# Altium schematic sheet 6ways-IDC-Cable-Tester.SchDoc
size A3; CompanyName: RELECTRIFY PTY LTD; Address1: Unit 4 113-117 Adderley St; Address2: West Melbourne, Victoria; Address3: Australia 3003; ProjectName: ProjectName
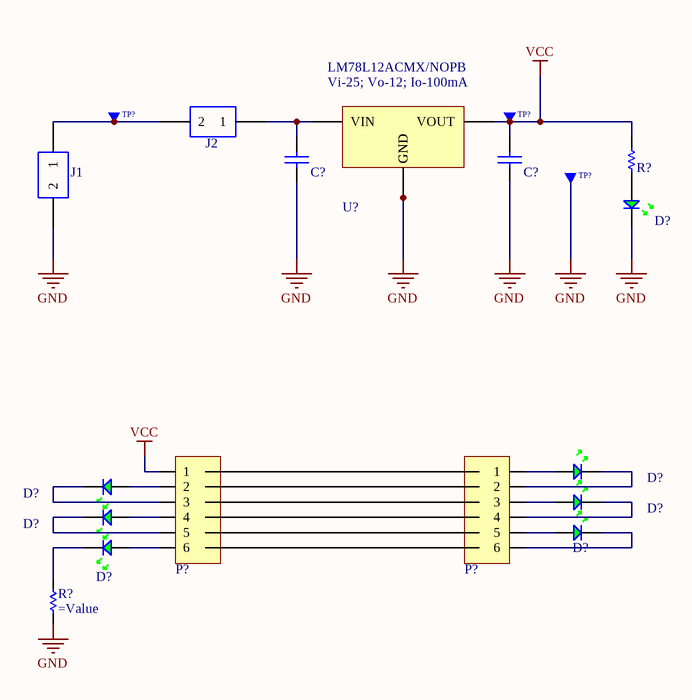
[diagram p0: 6ways-IDC-Cable-Tester.SchDoc]

## Parts
(Parts that share a designator on the sheet are numbered #1, #2 ... from top to bottom, then left to right.)
C?#1  1µF  [0603C]  (value not drawn)
C?#2  0.1µF  [0603C]  (value not drawn)
D?#1  (no value)  [0805D]
D?#2  (no value)  [0805D]
D?#3  (no value)  [0805D]
D?#4  (no value)  [0805D]
D?#5  (no value)  [0805D]
D?#6  (no value)  [0805D]
D?#7  (no value)  [0805D]
J1  69190-202HLF  [69190-202HLF]  (value not drawn)
J2  69190-202HLF  [69190-202HLF]  (value not drawn)
P?#1  SHF-103-01-L-D-SM  [SHF-103-01-L-D-SM]  (value not drawn)
P?#2  SHF-103-01-L-D-SM  [SHF-103-01-L-D-SM]  (value not drawn)
R?#1  0R  [0603R]  (value not drawn)
R?#2  (no value)
TP?#1  1.8mm Pad  [TEST PAD 1.8MM]  (value not drawn)  (no BOM)
TP?#2  1.8mm Pad  [TEST PAD 1.8MM]  (value not drawn)  (no BOM)
TP?#3  1.8mm Pad  [TEST PAD 1.8MM]  (value not drawn)  (no BOM)
U?  UA78M05IDCYR  [UA78M05IDCYR]  (value not drawn)

## Nets
GND: C?#1.2 C?#2.2 D?#1.2(G_K) J1.2 R?#2.1 TP?#3.1 U?.2(GND) U?.4(GND)
VCC: C?#2.1 P?#1.1 R?#1.1 TP?#2.1 U?.3(VOUT)
NetC?#1_1: C?#1.1 J2.1 U?.1(VIN)
NetD?#1_1: D?#1.1(G_A) R?#1.2
NetD?#2_1: D?#2.1(G_A) P?#2.1
NetD?#2_2: D?#2.2(G_K) P?#2.2
NetD?#3_1: D?#3.1(G_A) P?#1.2
NetD?#3_2: D?#3.2(G_K) P?#1.3
NetD?#4_1: D?#4.1(G_A) P?#2.3
NetD?#4_2: D?#4.2(G_K) P?#2.4
NetD?#5_1: D?#5.1(G_A) P?#1.4
NetD?#5_2: D?#5.2(G_K) P?#1.5
NetD?#6_1: D?#6.1(G_A) P?#2.5
NetD?#6_2: D?#6.2(G_K) P?#2.6
NetD?#7_1: D?#7.1(G_A) P?#1.6
NetD?#7_2: D?#7.2(G_K) R?#2.2
NetJ1_1: J1.1 J2.2 TP?#1.1

## Notes on the sheet
- (near U?) LM78L12ACMX/NOPB
- Vi-25; Vo-12; Io-100mA
- Title:
- This document contains information confidential and proprietary to Relectrify Pty. Ltd. and shall not be reproduced or transferred to other documents or disclosed to others or used for any other purpose other than which it was obtained without the express written consent of Relectrify Pty. Ltd.
- Release History
- Sheet No:
- PCBA:
- Sheet:
- DRW No:
- of
- v
- PCB:
- Format: A3
- Index
- ECR
- Date
- Drawn
- Check
- Comment
- File:

## Library data of the parts
C?#1 = 1000-0094: CAP CER 1UF 25V X5R 0603; Manufacturer PN: CC0603KRX5R8BB105; Manufacturer: Yageo; id: 427010; inventory_price: 0.03236; reorder_quantity: 0; x_max_temp: 85°C; x_min_temp: -55°C; x_Tolerance: ±10%; Relectrify PN: 1000-0094; ComponentLink1Description: Datasheet; ComponentLink1URL: https://www.yageo.com/upload/media/product/productsearch/datasheet/mlcc/UPY-GPHC_X5R_4V-to-50V_26.pdf; created_on: 8/04/2021 12:21:35 PM; parttype: Ceramic Capacitors; rohs: 1; updated_on: 1/12/2023 11:58:19 PM; x_Capacitance: 1µF; x_temp_coef: X5R; x_vol: 25V
C?#2 = 1000-0003: CAP CER 0.1UF 25V X7R 0603; Manufacturer PN: CL10B104KA8NNNC; Manufacturer: Samsung Electro-Mechanics; Value: 0.1µ; id: 376112; reorder_quantity: 0; x_current: Not Applicable; x_max_temp: 125°C; x_min_temp: -55°C; x_mounting_type: Surface Mount, MLCC; x_package_name: 0603 (1608 Metric); x_port_to_unleashed: no; x_product_status: Unknown; x_Tolerance: ±10%; Relectrify PN: 1000-0003; ComponentLink1Description: Datasheet; ComponentLink1URL: https://media.digikey.com/pdf/Data%20Sheets/Samsung%20PDFs/CL10B104KA8NNNC_Spec.pdf; created_on: 4/03/2020 6:56:10 PM; parttype: Ceramic Capacitors; rohs: 1; updated_on: 2/12/2023 12:40:53 AM; x_Capacitance: 0.1µF; x_digikey_pn: 1276-1006-1-ND; x_inductance: Not Applicable; x_power: Not Applicable; x_resistance: Not Applicable; x_temp_coef: X7R; x_vol: 25V
D?#1-D?#7 = 1001-0001: LED GREEN CLEAR 0805 SMD; Manufacturer PN: 150080GS75000; Manufacturer: Würth Elektronik; id: 376117; inventory_price: 0.18; reorder_quantity: 0; x_Capacitance: Not Applicable; x_port_to_unleashed: No; ComponentLink1Description: Datasheet; ComponentLink1URL: https://www.we-online.com/katalog/datasheet/150080GS75000.pdf; Relectrify PN: 1001-0001; created_on: 4/03/2020 7:22:47 PM; parttype: LED Indication - Discrete; rohs: 1; updated_on: 2/12/2023 12:15:00 AM; x_current: Not Applicable; x_inductance: Not Applicable; x_max_temp: N/A; x_min_temp: N/A; x_power: Not Applicable; x_resistance: Not Applicable; x_temp_coef: Not Applicable; x_Tolerance: Not Applicable; x_vol: Not Applicable
J1 J2 = 1005-0038: CONN HEADER VERT 2POS 2.54MM; Manufacturer: Amphenol ICC (FCI); MP: SAMTEC-HTSW-102-07-X-S; MF: Samtec Inc.; id: 444038; inventory_price: 0.37; reorder_quantity: 0; x_Capacitance: Not Applicable; x_current: 3A; x_max_temp: 130°C; x_min_temp: -65°C; x_port_to_unleashed: No; Availability: Unavailable; Package: None; Price: None; Relectrify PN: 1005-0038; Manufacturer PN: 69190-202HLF; ComponentLink1Description: Datasheet; ComponentLink1URL: https://cdn.amphenol-icc.com/media/wysiwyg/files/drawing/69190.pdf; created_on: 4/11/2021 10:02:44 AM; parttype: Rectangular Connectors - Headers, Male Pins; rohs: 0; updated_on: 2/12/2023 12:16:53 AM; x_inductance: Not Applicable; x_power: Not Applicable; x_resistance: Not Applicable; x_temp_coef: Not Applicable; x_Tolerance: Not Applicable; x_vol: Not Applicable
P?#1 P?#2 = 1005-0095: CONN HEADER SMD 6POS 1.27MM; Manufacturer: Samtec Inc.; id: 541962; inventory_price: 3.42; reorder_quantity: 0; x_Capacitance: Not Applicable; x_current: 3A; x_max_temp: 125°C; x_min_temp: -55°C; x_port_to_unleashed: No; Relectrify PN: 1005-0095; Manufacturer PN: SHF-103-01-L-D-SM; ComponentLink1Description: Datasheet; ComponentLink1URL: https://mm.digikey.com/Volume0/opasdata/d220001/medias/docus/6129/shf-1xx-01-x-d-xx-xx-xx-mkt.pdf; created_on: 31/07/2024 11:58:55 AM; parttype: Rectangular Connectors - Headers, Male Pins; rohs: 1; updated_on: 16/08/2024 1:20:53 PM; x_inductance: Not Applicable; x_power: Not Applicable; x_resistance: Not Applicable; x_temp_coef: Not Applicable; x_Tolerance: Not Applicable; x_vol: Not Applicable
R?#1 = 1007-0003: RES 0 OHM JUMPER 0603; Manufacturer PN: RK73Z1JTTD; Manufacturer: KOA Speer Electronics, Inc.; Value: 0; id: 376217; x_Capacitance: Not Applicable; x_max_temp: 155°C; x_min_temp: -55°C; x_package_name: 0603 (1608 Metric); x_port_to_unleashed: no; x_product_status: Unknown; Relectrify PN: 1007-0003; ComponentLink1Description: Datasheet; ComponentLink1URL: https://www.koaspeer.com/pdfs/RK73Z.pdf; created_on: 5/03/2020 8:25:29 PM; parttype: Chip Resistor - Surface Mount; reorder_quantity: 0; rohs: 1; updated_on: 2/12/2023 12:40:49 AM; x_current: Not Applicable; x_digikey_pn: 2019-RK73Z1JTTDCT-ND; x_inductance: Not Applicable; x_power: -; x_resistance: 0R; x_temp_coef: -; x_Tolerance: Jumper; x_vol: Not Applicable
R?#2 = Resistor: Generic Resistor
TP?#1-TP?#3 = 1302-0010: Test Point 100mil Pitch 1.8mm Pad; Manufacturer: Relectrify Pty Ltd; Value: 1.8; id: 511445; reorder_quantity: 0; Relectrify PN: 1302-0010; Manufacturer PN: 1302-0010; created_on: 8/08/2023 10:45:56 AM; parttype: Non-BOM PCB Footprints; rohs: 1; updated_on: 2/12/2023 12:41:23 AM
U? = 1322-0011: IC REG LINEAR 5V 500MA SOT223-4; Manufacturer: Texas Instruments; id: 526755; inventory_price: 0.63; reorder_quantity: 0; Relectrify PN: 1322-0011; Manufacturer PN: UA78M05IDCYR; ComponentLink1Description: Datasheet; ComponentLink1URL: https://www.ti.com/lit/ds/slvs059t/slvs059t.pdf; created_on: 15/03/2024 9:19:32 AM; parttype: Power Management (PMIC) - Voltage Regulators - Linear, Low Drop Out (LDO) Regulators; rohs: 1; updated_on: 15/03/2024 9:21:41 AM